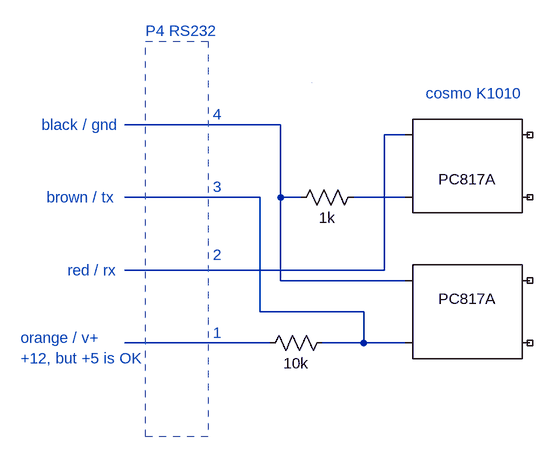
[diagram p0: schematic PSP-603 internal.asc]
PSP-603 internal.asc, the LTspice schematic file:
Version 4
SHEET 1 880 680
WIRE -48 64 -288 64
WIRE 144 80 112 80
WIRE -80 176 -288 176
WIRE -48 176 -48 64
WIRE -16 176 -48 176
WIRE 144 176 64 176
WIRE 112 288 112 80
WIRE 112 288 -288 288
WIRE -48 304 -48 176
WIRE 144 304 -48 304
WIRE -80 352 -80 176
WIRE 80 352 -80 352
WIRE -64 400 -288 400
WIRE 80 400 80 352
WIRE 80 400 16 400
WIRE 144 400 80 400
WIRE 0 0 0 0
SYMBOL Optos\\PC817A 240 128 R0
WINDOW 0 0 -80 Invisible 2
SYMATTR InstName U1
SYMBOL Optos\\PC817A 240 352 R180
WINDOW 0 0 -80 Invisible 2
SYMATTR InstName U2
SYMBOL res 80 160 R90
WINDOW 0 0 56 Invisible 2
WINDOW 3 32 56 VTop 2
SYMATTR InstName R1
SYMATTR Value 1k
SYMBOL res 32 384 R90
WINDOW 0 0 56 Invisible 2
WINDOW 3 32 56 VTop 2
SYMATTR InstName R2
SYMATTR Value 10k
TEXT -152 384 Left 2 ;1
TEXT -152 264 Left 2 ;2
TEXT -152 160 Left 2 ;3
TEXT -152 48 Left 2 ;4
TEXT -416 64 Left 2 ;black / gnd
TEXT -408 176 Left 2 ;brown / tx
TEXT -376 288 Left 2 ;red / rx
TEXT -448 392 Left 2 ;orange / v+\n+12, but +5 is OK
TEXT 176 16 Left 2 ;cosmo K1010
TEXT -256 -80 Left 2 ;P4 RS232
RECTANGLE Normal -160 544 -256 -64 2

The netlist it stands for:
* PSP-603 internal.asc
XU1 N002 N004 NC_01 NC_02 PC817 Igain=1m
XU2 NC_03 NC_04 N003 N001 PC817 Igain=1m
R1 N004 N001 1k
R2 N003 N005 10k
* 1
* 2
* 3
* 4
* black / gnd
* brown / tx
* red / rx
* orange / v+
* +12, but +5 is OK
* cosmo K1010
* P4 RS232
.lib PC817.sub
.backanno
.end